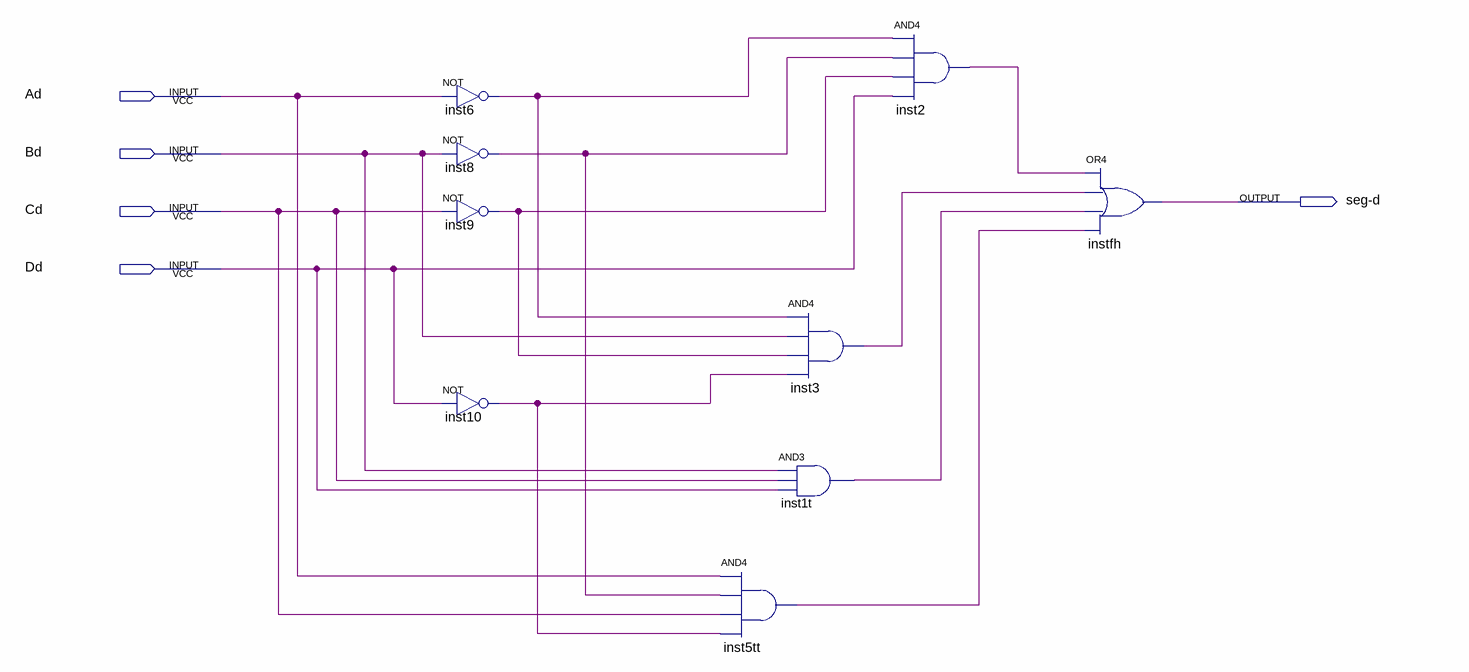
[diagram p0: schematic sheet]
// Quartus schematic segmento_d.bdf as structural Verilog: 9 symbols, 5 pins
module segmento_d (
  input  Ad,
  input  Bd,
  input  Cd,
  input  Dd,
  output \seg-d 
);

  wire inst1t_out, inst2_out, inst3_out, inst5tt_out, inst6_out, inst8_out, inst9_out, inst10_out;

  not inst6 (inst6_out, Ad);
  not inst8 (inst8_out, Bd);
  not inst9 (inst9_out, Cd);
  not inst10 (inst10_out, Dd);
  and inst3 (inst3_out, inst6_out, Bd, inst9_out, inst10_out);
  and inst1t (inst1t_out, Bd, Cd, Dd);
  and inst5tt (inst5tt_out, Ad, inst8_out, Cd, inst10_out);
  and inst2 (inst2_out, inst6_out, inst8_out, inst9_out, Dd);
  or instfh (\seg-d , inst2_out, inst3_out, inst1t_out, inst5tt_out);
endmodule
